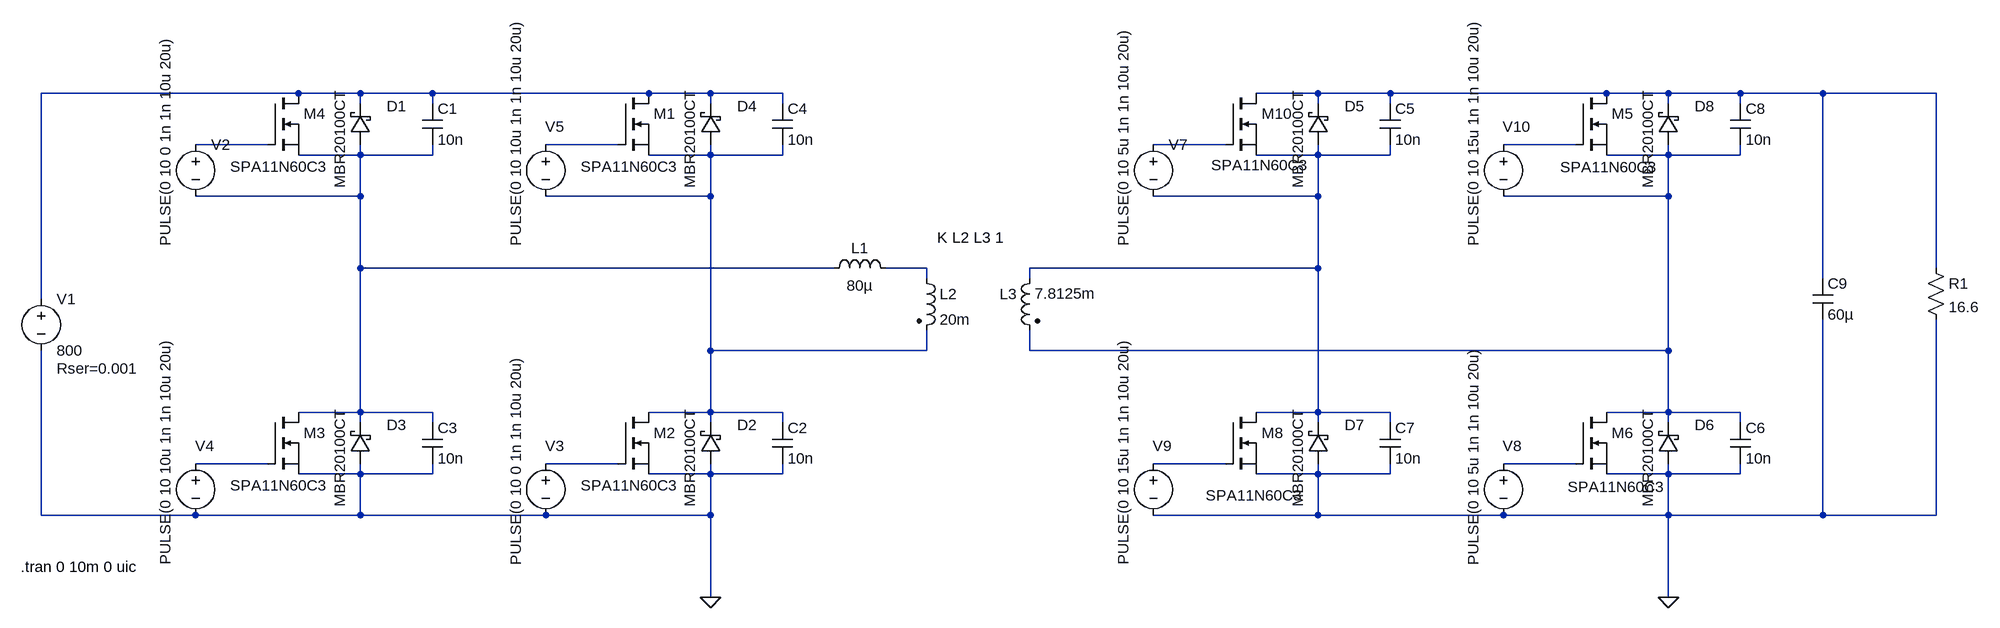
[diagram p0: schematic Draft3.asc]
Draft3.asc, the LTspice schematic file:
Version 4
SHEET 1 3052 804
WIRE 400 -96 0 -96
WIRE 496 -96 400 -96
WIRE 608 -96 496 -96
WIRE 944 -96 608 -96
WIRE 1040 -96 944 -96
WIRE 1152 -96 1040 -96
WIRE 1984 -96 1888 -96
WIRE 2096 -96 1984 -96
WIRE 2432 -96 2096 -96
WIRE 2528 -96 2432 -96
WIRE 2640 -96 2528 -96
WIRE 2768 -96 2640 -96
WIRE 2944 -96 2768 -96
WIRE 496 -80 496 -96
WIRE 608 -80 608 -96
WIRE 1040 -80 1040 -96
WIRE 1152 -80 1152 -96
WIRE 1984 -80 1984 -96
WIRE 2096 -80 2096 -96
WIRE 2528 -80 2528 -96
WIRE 2640 -80 2640 -96
WIRE 352 -16 240 -16
WIRE 896 -16 784 -16
WIRE 1840 -16 1728 -16
WIRE 2384 -16 2272 -16
WIRE 496 0 496 -16
WIRE 496 0 400 0
WIRE 608 0 608 -16
WIRE 608 0 496 0
WIRE 1040 0 1040 -16
WIRE 1040 0 944 0
WIRE 1152 0 1152 -16
WIRE 1152 0 1040 0
WIRE 1984 0 1984 -16
WIRE 1984 0 1888 0
WIRE 2096 0 2096 -16
WIRE 2096 0 1984 0
WIRE 2528 0 2528 -16
WIRE 2528 0 2432 0
WIRE 2640 0 2640 -16
WIRE 2640 0 2528 0
WIRE 496 64 496 0
WIRE 496 64 240 64
WIRE 1040 64 1040 0
WIRE 1040 64 784 64
WIRE 1984 64 1984 0
WIRE 1984 64 1728 64
WIRE 2528 64 2528 0
WIRE 2528 64 2272 64
WIRE 496 176 496 64
WIRE 1232 176 496 176
WIRE 1376 176 1312 176
WIRE 1984 176 1984 64
WIRE 1984 176 1536 176
WIRE 2944 176 2944 -96
WIRE 1376 192 1376 176
WIRE 1536 192 1536 176
WIRE 2768 192 2768 -96
WIRE 0 224 0 -96
WIRE 1040 304 1040 64
WIRE 1376 304 1376 272
WIRE 1376 304 1040 304
WIRE 1536 304 1536 272
WIRE 2528 304 2528 64
WIRE 2528 304 1536 304
WIRE 496 400 496 176
WIRE 496 400 400 400
WIRE 608 400 496 400
WIRE 1040 400 1040 304
WIRE 1040 400 944 400
WIRE 1152 400 1040 400
WIRE 1984 400 1984 176
WIRE 1984 400 1888 400
WIRE 2096 400 1984 400
WIRE 2528 400 2528 304
WIRE 2528 400 2432 400
WIRE 2640 400 2528 400
WIRE 496 416 496 400
WIRE 608 416 608 400
WIRE 1040 416 1040 400
WIRE 1152 416 1152 400
WIRE 1984 416 1984 400
WIRE 2096 416 2096 400
WIRE 2528 416 2528 400
WIRE 2640 416 2640 400
WIRE 352 480 240 480
WIRE 896 480 784 480
WIRE 1840 480 1728 480
WIRE 2384 480 2272 480
WIRE 496 496 496 480
WIRE 496 496 400 496
WIRE 608 496 608 480
WIRE 608 496 496 496
WIRE 1040 496 1040 480
WIRE 1040 496 944 496
WIRE 1152 496 1152 480
WIRE 1152 496 1040 496
WIRE 1984 496 1984 480
WIRE 1984 496 1888 496
WIRE 2096 496 2096 480
WIRE 2096 496 1984 496
WIRE 2528 496 2528 480
WIRE 2528 496 2432 496
WIRE 2640 496 2640 480
WIRE 2640 496 2528 496
WIRE 0 560 0 304
WIRE 240 560 0 560
WIRE 496 560 496 496
WIRE 496 560 240 560
WIRE 784 560 496 560
WIRE 1040 560 1040 496
WIRE 1040 560 784 560
WIRE 1984 560 1984 496
WIRE 1984 560 1728 560
WIRE 2272 560 1984 560
WIRE 2528 560 2528 496
WIRE 2528 560 2272 560
WIRE 2768 560 2768 256
WIRE 2768 560 2528 560
WIRE 2944 560 2944 256
WIRE 2944 560 2768 560
WIRE 1040 688 1040 560
WIRE 2528 688 2528 560
FLAG 1040 688 0
FLAG 2528 688 0
SYMBOL voltage 0 208 R0
WINDOW 123 0 0 Left 0
WINDOW 39 24 124 Left 2
SYMATTR SpiceLine Rser=0.001
SYMATTR InstName V1
SYMATTR Value 800
SYMBOL voltage 240 -32 R0
WINDOW 3 -47 174 VLeft 2
WINDOW 123 0 0 Left 0
WINDOW 39 0 0 Left 0
SYMATTR Value PULSE(0 10 0 1n 1n 10u 20u)
SYMATTR InstName V2
SYMBOL schottky 512 -16 R180
WINDOW 0 -56 60 Left 2
WINDOW 3 48 -68 VRight 2
SYMATTR InstName D1
SYMATTR Value MBR20100CT
SYMATTR Description Zener Diode
SYMATTR Type zener
SYMBOL cap 592 -80 R0
SYMATTR InstName C1
SYMATTR Value 10n
SYMBOL voltage 784 464 R0
WINDOW 0 -1 -12 Left 2
WINDOW 3 -47 174 VLeft 2
WINDOW 123 0 0 Left 0
WINDOW 39 0 0 Left 0
SYMATTR InstName V3
SYMATTR Value PULSE(0 10 0 1n 1n 10u 20u)
SYMBOL schottky 1056 480 R180
WINDOW 0 -56 60 Left 2
WINDOW 3 48 -68 VRight 2
SYMATTR InstName D2
SYMATTR Value MBR20100CT
SYMATTR Description Zener Diode
SYMATTR Type zener
SYMBOL cap 1136 416 R0
SYMATTR InstName C2
SYMATTR Value 10n
SYMBOL voltage 240 464 R0
WINDOW 0 -1 -12 Left 2
WINDOW 3 -47 174 VLeft 2
WINDOW 123 0 0 Left 0
WINDOW 39 0 0 Left 0
SYMATTR InstName V4
SYMATTR Value PULSE(0 10 10u 1n 1n 10u 20u)
SYMBOL schottky 512 480 R180
WINDOW 0 -56 60 Left 2
WINDOW 3 48 -68 VRight 2
SYMATTR InstName D3
SYMATTR Value MBR20100CT
SYMATTR Description Zener Diode
SYMATTR Type zener
SYMBOL cap 592 416 R0
SYMATTR InstName C3
SYMATTR Value 10n
SYMBOL voltage 784 -32 R0
WINDOW 0 -1 -12 Left 2
WINDOW 3 -47 174 VLeft 2
WINDOW 123 0 0 Left 0
WINDOW 39 0 0 Left 0
SYMATTR InstName V5
SYMATTR Value PULSE(0 10 10u 1n 1n 10u 20u)
SYMBOL schottky 1056 -16 R180
WINDOW 0 -56 60 Left 2
WINDOW 3 48 -68 VRight 2
SYMATTR InstName D4
SYMATTR Value MBR20100CT
SYMATTR Description Zener Diode
SYMATTR Type zener
SYMBOL cap 1136 -80 R0
SYMATTR InstName C4
SYMATTR Value 10n
SYMBOL ind 1216 192 R270
WINDOW 0 32 56 VTop 2
WINDOW 3 5 56 VBottom 2
SYMATTR InstName L1
SYMATTR Value 80µ
SYMBOL ind2 1360 176 R0
SYMATTR InstName L2
SYMATTR Value 20m
SYMATTR Type ind
SYMBOL ind2 1552 176 M0
WINDOW 3 -86 39 Left 2
SYMATTR Value 7.8125m
SYMATTR InstName L3
SYMATTR Type ind
SYMBOL voltage 1728 -32 R0
WINDOW 3 -47 174 VLeft 2
WINDOW 123 0 0 Left 0
WINDOW 39 0 0 Left 0
SYMATTR Value PULSE(0 10 5u 1n 1n 10u 20u)
SYMATTR InstName V7
SYMBOL schottky 2000 -16 R180
WINDOW 0 -56 60 Left 2
WINDOW 3 48 -68 VRight 2
SYMATTR InstName D5
SYMATTR Value MBR20100CT
SYMATTR Description Zener Diode
SYMATTR Type zener
SYMBOL cap 2080 -80 R0
SYMATTR InstName C5
SYMATTR Value 10n
SYMBOL voltage 2272 464 R0
WINDOW 0 -1 -12 Left 2
WINDOW 3 -47 174 VLeft 2
WINDOW 123 0 0 Left 0
WINDOW 39 0 0 Left 0
SYMATTR InstName V8
SYMATTR Value PULSE(0 10 5u 1n 1n 10u 20u)
SYMBOL schottky 2544 480 R180
WINDOW 0 -56 60 Left 2
WINDOW 3 48 -68 VRight 2
SYMATTR InstName D6
SYMATTR Value MBR20100CT
SYMATTR Description Zener Diode
SYMATTR Type zener
SYMBOL cap 2624 416 R0
SYMATTR InstName C6
SYMATTR Value 10n
SYMBOL voltage 1728 464 R0
WINDOW 0 -1 -12 Left 2
WINDOW 3 -47 174 VLeft 2
WINDOW 123 0 0 Left 0
WINDOW 39 0 0 Left 0
SYMATTR InstName V9
SYMATTR Value PULSE(0 10 15u 1n 1n 10u 20u)
SYMBOL schottky 2000 480 R180
WINDOW 0 -56 60 Left 2
WINDOW 3 48 -68 VRight 2
SYMATTR InstName D7
SYMATTR Value MBR20100CT
SYMATTR Description Zener Diode
SYMATTR Type zener
SYMBOL cap 2080 416 R0
SYMATTR InstName C7
SYMATTR Value 10n
SYMBOL voltage 2272 -32 R0
WINDOW 0 -1 -12 Left 2
WINDOW 3 -47 174 VLeft 2
WINDOW 123 0 0 Left 0
WINDOW 39 0 0 Left 0
SYMATTR InstName V10
SYMATTR Value PULSE(0 10 15u 1n 1n 10u 20u)
SYMBOL schottky 2544 -16 R180
WINDOW 0 -56 60 Left 2
WINDOW 3 48 -68 VRight 2
SYMATTR InstName D8
SYMATTR Value MBR20100CT
SYMATTR Description Zener Diode
SYMATTR Type zener
SYMBOL cap 2624 -80 R0
SYMATTR InstName C8
SYMATTR Value 10n
SYMBOL cap 2752 192 R0
SYMATTR InstName C9
SYMATTR Value 60µ
SYMBOL res 2928 160 R0
SYMATTR InstName R1
SYMATTR Value 16.6
SYMBOL nmos 1840 -96 R0
WINDOW 3 -22 112 Left 2
SYMATTR Value SPA11N60C3
SYMATTR InstName M10
SYMBOL nmos 2384 -96 R0
WINDOW 3 -24 115 Left 2
SYMATTR Value SPA11N60C3
SYMATTR InstName M5
SYMBOL nmos 2384 400 R0
WINDOW 3 -12 116 Left 2
SYMATTR Value SPA11N60C3
SYMATTR InstName M6
SYMBOL nmos 1840 400 R0
WINDOW 3 -31 129 Left 2
SYMATTR Value SPA11N60C3
SYMATTR InstName M8
SYMBOL nmos 896 -96 R0
WINDOW 3 -58 114 Left 2
SYMATTR Value SPA11N60C3
SYMATTR InstName M1
SYMBOL nmos 896 400 R0
WINDOW 3 -58 114 Left 2
SYMATTR Value SPA11N60C3
SYMATTR InstName M2
SYMBOL nmos 352 400 R0
WINDOW 3 -58 114 Left 2
SYMATTR Value SPA11N60C3
SYMATTR InstName M3
SYMBOL nmos 352 -96 R0
WINDOW 3 -58 114 Left 2
SYMATTR Value SPA11N60C3
SYMATTR InstName M4
TEXT 1392 128 Left 2 !K L2 L3 1
TEXT -32 640 Left 2 !.tran 0 10m 0 uic

The netlist it stands for:
* Draft3.asc
V1 N001 0 800 Rser=0.001
V2 N003 N007 PULSE(0 10 0 1n 1n 10u 20u)
D1 N007 N001 MBR20100CT
C1 N001 N007 10n
V3 N013 0 PULSE(0 10 0 1n 1n 10u 20u)
D2 0 N008 MBR20100CT
C2 N008 0 10n
V4 N012 0 PULSE(0 10 10u 1n 1n 10u 20u)
D3 0 N007 MBR20100CT
C3 N007 0 10n
V5 N004 N008 PULSE(0 10 10u 1n 1n 10u 20u)
D4 N008 N001 MBR20100CT
C4 N001 N008 10n
L1 N007 N011 80µ
L2 N011 N008 20m
L3 N009 N010 7.8125m
V7 N005 N009 PULSE(0 10 5u 1n 1n 10u 20u)
D5 N009 N002 MBR20100CT
C5 N002 N009 10n
V8 N015 0 PULSE(0 10 5u 1n 1n 10u 20u)
D6 0 N010 MBR20100CT
C6 N010 0 10n
V9 N014 0 PULSE(0 10 15u 1n 1n 10u 20u)
D7 0 N009 MBR20100CT
C7 N009 0 10n
V10 N006 N010 PULSE(0 10 15u 1n 1n 10u 20u)
D8 N010 N002 MBR20100CT
C8 N002 N010 10n
C9 N002 0 60µ
R1 N002 0 16.6
M10 N002 N005 N009 N009 SPA11N60C3
M5 N002 N006 N010 N010 SPA11N60C3
M6 N010 N015 0 0 SPA11N60C3
M8 N009 N014 0 0 SPA11N60C3
M1 N001 N004 N008 N008 SPA11N60C3
M2 N008 N013 0 0 SPA11N60C3
M3 N007 N012 0 0 SPA11N60C3
M4 N001 N003 N007 N007 SPA11N60C3
.model D D
.lib standard.dio
.model NMOS NMOS
.model PMOS PMOS
.lib standard.mos
K L2 L3 1
.tran 0 10m 0 uic
.backanno
.end